# Altium schematic sheet RadFET.SchDoc: RadFET
size A4
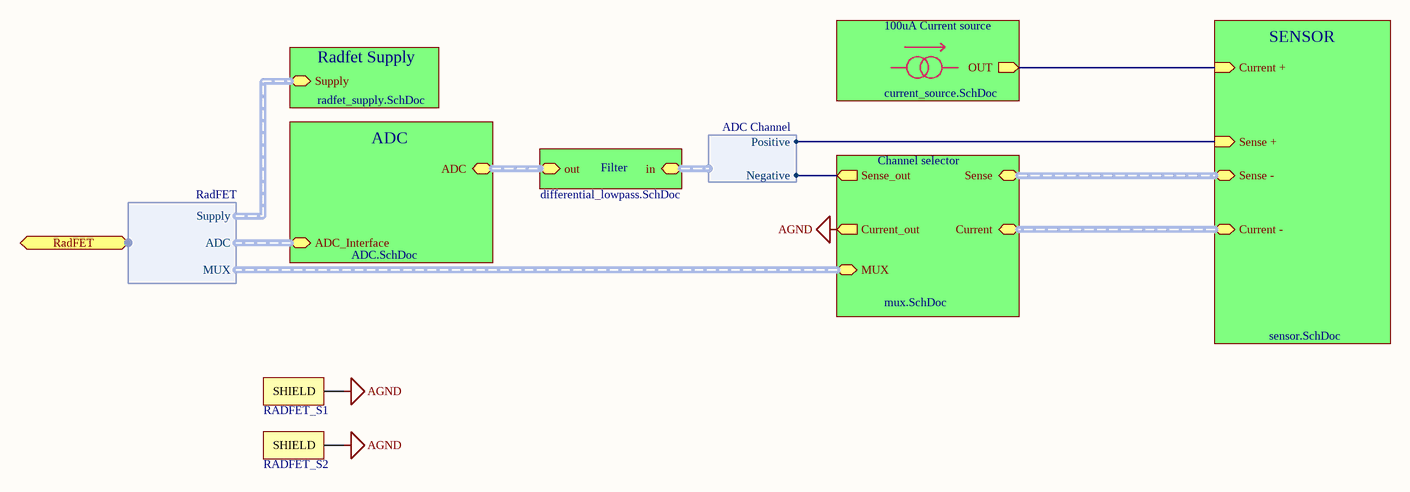
[diagram p0: RadFET.SchDoc]

## Parts
RADFET_S1  BMI-S-203-F  [BMI-S-203-F_NO3D]  (value not drawn)
RADFET_S2  BMI-S-203-F  [BMI-S-203-F_NO3D]  (value not drawn)

## Sub-sheets
100uA Current source = current_source.SchDoc: OUT (out)
ADC = ADC.SchDoc: ADC (harness ADC Channel), ADC_Interface (harness ADC_DIGITAL)
Channel selector = mux.SchDoc: Sense_out (out), Sense (harness ADG709_MUX_CH), Current (harness ADG709_MUX_CH), MUX (harness ADG709_MUX), Current_out (out)
Filter = differential_lowpass.SchDoc: in (harness ADC Channel), out (harness ADC Channel)
Radfet Supply = radfet_supply.SchDoc: Supply (harness RadFET-supply)
SENSOR = sensor.SchDoc: Sense + (in), Current + (in), Current - (harness ADG709_MUX_CH), Sense - (harness ADG709_MUX_CH)

## Ports
RadFET (harness RadFET)

## Harnesses
RadFET: ADC, MUX, Supply
ADC Channel: Positive, Negative

## Nets
AGND: RADFET_S1.0(SHIELD) RADFET_S2.0(SHIELD) ; sheet Channel selector/Current_out
(unnamed): sheet 100uA Current source/OUT, sheet SENSOR/Current +
(unnamed): sheet Channel selector/Sense_out, sheet Filter/in.Negative
(unnamed): sheet SENSOR/Sense +, sheet Filter/in.Positive

## Buses and harness runs
harness sheet ADC/ADC = sheet Filter/out
harness sheet Channel selector/Current = sheet SENSOR/Current -
harness sheet Channel selector/Sense = sheet SENSOR/Sense -

## Notes on the sheet
- Title:
- Project:
- Author:
- Model:
- Document Number:
- Checked by:
- Rev:
- Date:
- Approved by:
- Sheet:
- of
- File name:

## Library data of the parts
RADFET_S1 RADFET_S2 = BMI-S-203-F: STANDARD SURFACE MOUNT SHIELD TWO-PIECE 26.21x26.21x5.08mm